# EAGLE design caliper (EAGLE 6.4)
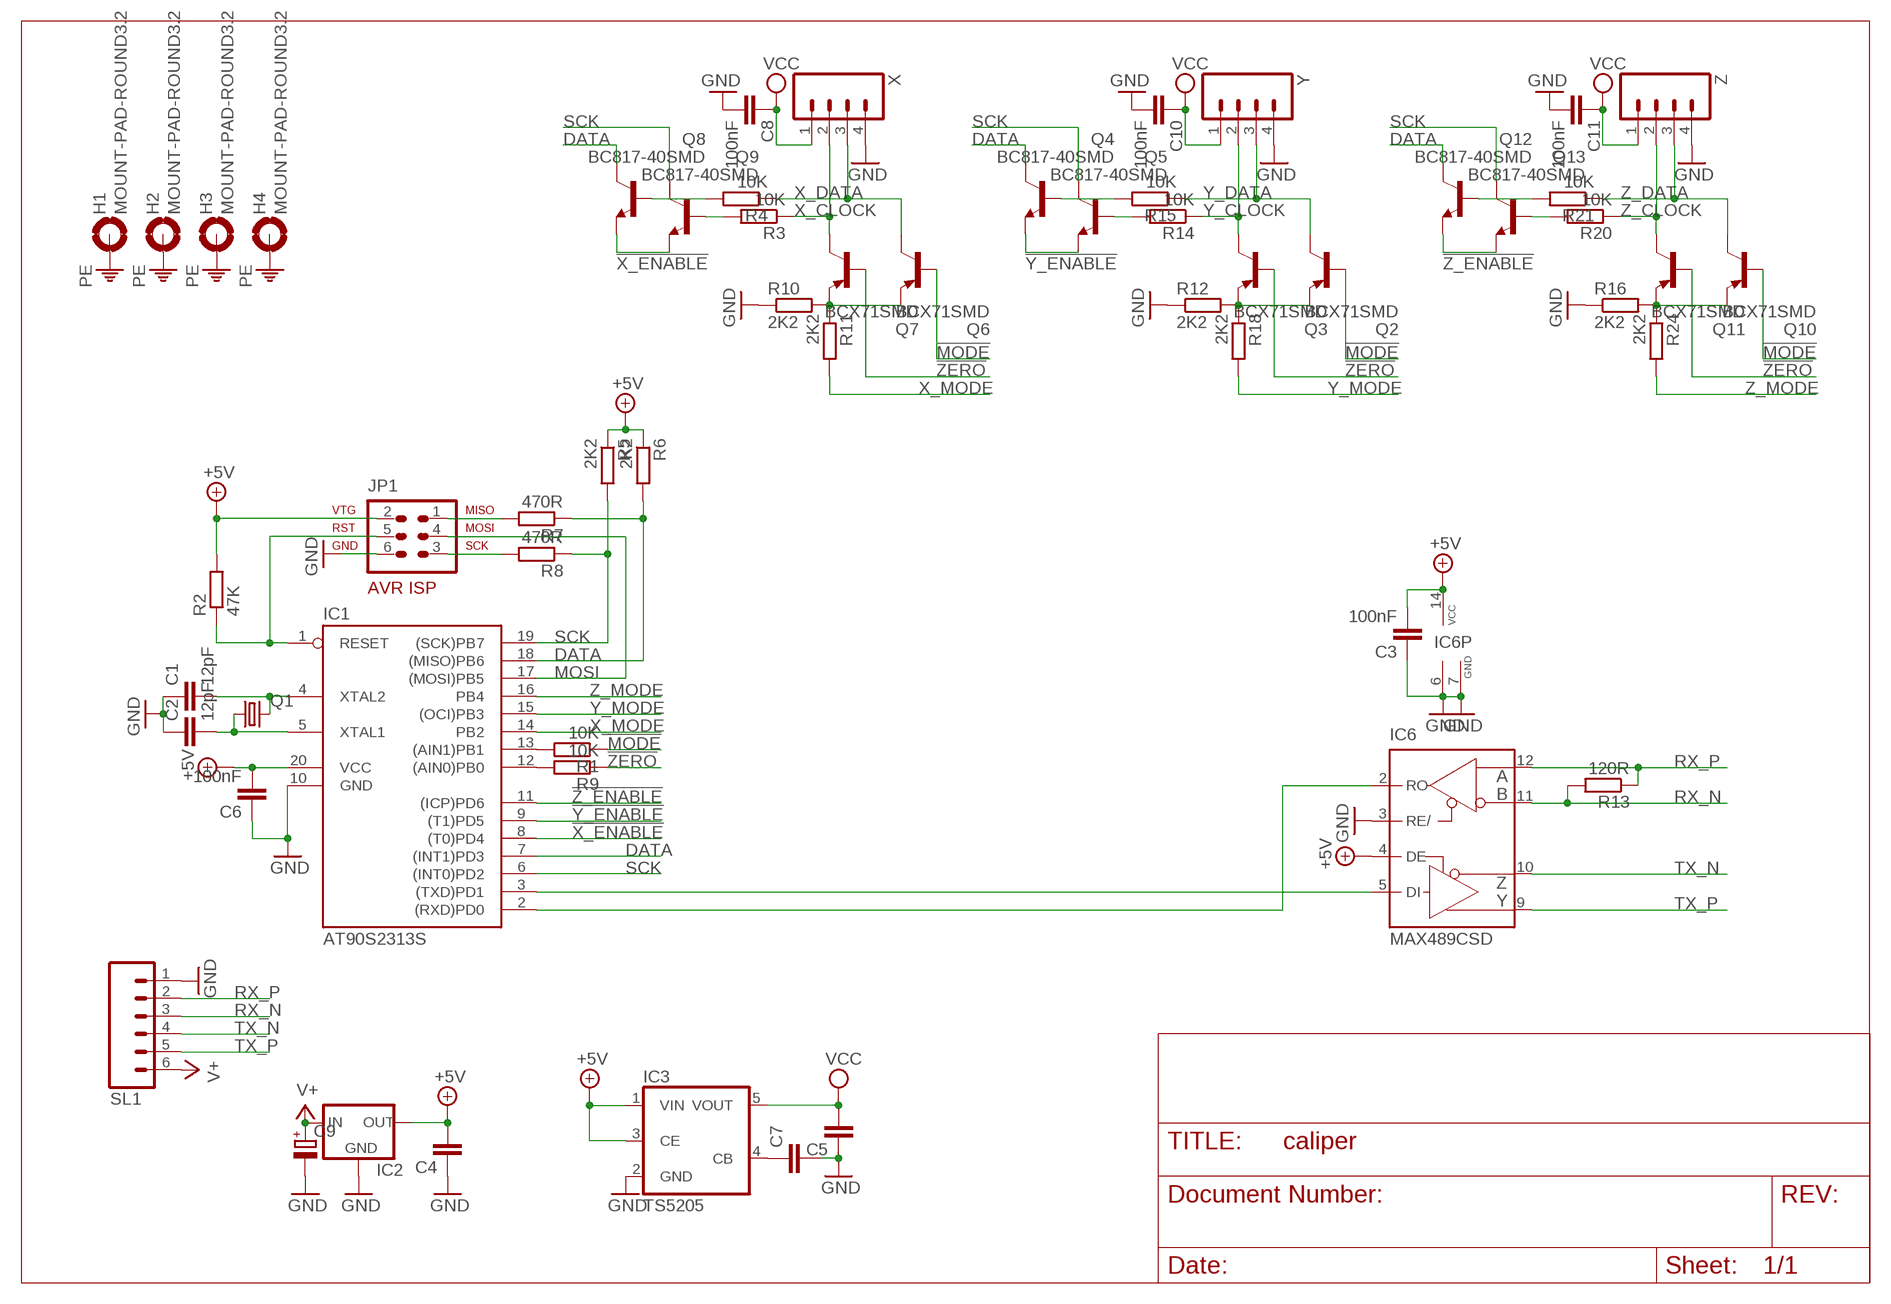
[diagram p0: schematic, sheet 1]

## Parts
C1  12pF  C-EUC0805  [C0805]
C2  12pF  C-EUC0805  [C0805]
C3  100nF  C-EUC0805  [C0805]
C4  C-EUC0805  [C0805]
C5  C-EUC0805  [C0805]
C6  100nF  C-EUC0805  [C0805]
C7  C-EUC0805  [C0805]
C8  100nF  C-EUC0805  [C0805]
C9  CPOL-EUE3.5-8  [E3,5-8]
C10  100nF  C-EUC0805  [C0805]
C11  100nF  C-EUC0805  [C0805]
H1  MOUNT-PAD-ROUND3.2  [3,2-PAD]
H2  MOUNT-PAD-ROUND3.2  [3,2-PAD]
H3  MOUNT-PAD-ROUND3.2  [3,2-PAD]
H4  MOUNT-PAD-ROUND3.2  [3,2-PAD]
IC1  AT90S2313S  [SO20L]
IC2  78XXS  [78XXS]
IC3  TS5205  [SOT25]
IC6  MAX489CSD  [SO14]
JP1  AVR-ISP-6  [AVR-ISP-6]
Q1  CRYTALHC49S  [HC49/S]
Q2  BCX71SMD  [SOT23]
Q3  BCX71SMD  [SOT23]
Q4  BC817-40SMD  [SOT23-BEC]
Q5  BC817-40SMD  [SOT23-BEC]
Q6  BCX71SMD  [SOT23]
Q7  BCX71SMD  [SOT23]
Q8  BC817-40SMD  [SOT23-BEC]
Q9  BC817-40SMD  [SOT23-BEC]
Q10  BCX71SMD  [SOT23]
Q11  BCX71SMD  [SOT23]
Q12  BC817-40SMD  [SOT23-BEC]
Q13  BC817-40SMD  [SOT23-BEC]
R1  10K  R-EU_R0805  [R0805]
R2  47K  R-EU_R0805  [R0805]
R3  10K  R-EU_R0805  [R0805]
R4  10K  R-EU_R0805  [R0805]
R5  2K2  R-EU_R0805  [R0805]
R6  2K2  R-EU_R0805  [R0805]
R7  470R  R-EU_R0805  [R0805]
R8  470R  R-EU_R0805  [R0805]
R9  10K  R-EU_R0805  [R0805]
R10  2K2  R-EU_R0805  [R0805]
R11  2K2  R-EU_R0805  [R0805]
R12  2K2  R-EU_R0805  [R0805]
R13  120R  R-EU_R0805  [R0805]
R14  10K  R-EU_R0805  [R0805]
R15  10K  R-EU_R0805  [R0805]
R16  2K2  R-EU_R0805  [R0805]
R18  2K2  R-EU_R0805  [R0805]
R20  10K  R-EU_R0805  [R0805]
R21  10K  R-EU_R0805  [R0805]
R24  2K2  R-EU_R0805  [R0805]
SL1  M06  [06P]
X  M04  [04P]
Y  M04  [04P]
Z  M04  [04P]

## Nets
!MODE: Q2.1(B) Q6.1(B) Q10.1(B) R1.1
!X_ENABLE: IC1.8((T0)PD4) Q8.E Q9.E
!Y_ENABLE: IC1.9((T1)PD5) Q4.E Q5.E
!Z_ENABLE: IC1.11((ICP)PD6) Q12.E Q13.E
!ZERO: Q3.1(B) Q7.1(B) Q11.1(B) R9.1
+5V: C3.2 C4.2 C6.2 IC1.20(VCC) IC2.OUT IC3.1(VIN) IC3.3(CE) IC6.4(DE) IC6.14(VCC) JP1.2 R2.2 R5.1 R6.1
DATA: IC1.7((INT1)PD3) IC1.18((MISO)PB6) Q4.C Q8.C Q12.C R6.2 R7.1
GND: C1.1 C2.1 C3.1 C4.1 C5.1 C6.1 C7.2 C8.2 C9.- C10.2 C11.2 IC1.10(GND) IC2.GND IC3.2(GND) IC6.3(RE/) IC6.6(GND) IC6.7(GND) JP1.6 R10.1 R12.1 R16.1 SL1.1 X.4 Y.4 Z.4
MOSI: IC1.17((MOSI)PB5) JP1.4
N$1: C1.2 IC1.4(XTAL2) Q1.2
N$2: C2.2 IC1.5(XTAL1) Q1.1
N$3: IC1.2((RXD)PD0) IC6.2(RO)
N$4: IC1.3((TXD)PD1) IC6.5(DI)
N$5: JP1.1 R7.2
N$6: IC1.12((AIN0)PB0) R9.2
N$7: IC1.1(RESET) JP1.5 R2.1
N$8: IC1.13((AIN1)PB1) R1.2
N$9: Q6.2(E) Q7.2(E) R10.2 R11.1
N$10: C7.1 IC3.4(CB)
N$11: JP1.3 R8.2
N$12: Q4.B R15.2
N$13: Q12.B R21.2
N$15: Q8.B R4.2
N$16: Q9.B R3.2
N$17: Q5.B R14.2
N$20: Q2.2(E) Q3.2(E) R12.2 R18.1
N$21: Q13.B R20.2
N$24: Q10.2(E) Q11.2(E) R16.2 R24.1
PE: H1.B3,2(MOUNT) H2.B3,2(MOUNT) H3.B3,2(MOUNT) H4.B3,2(MOUNT)
RX_N: IC6.11(B) R13.2 SL1.3
RX_P: IC6.12(A) R13.1 SL1.2
SCK: IC1.6((INT0)PD2) IC1.19((SCK)PB7) Q5.C Q9.C Q13.C R5.2 R8.1
TX_N: IC6.10(Z) SL1.4
TX_P: IC6.9(Y) SL1.5
V+: C9.+ IC2.IN SL1.6
VCC: C5.2 C8.1 C10.1 C11.1 IC3.5(VOUT) X.1 Y.1 Z.1
X_CLOCK: Q7.3(C) R3.1 X.2
X_DATA: Q6.3(C) R4.1 X.3
X_MODE: IC1.14(PB2) R11.2
Y_CLOCK: Q3.3(C) R14.1 Y.2
Y_DATA: Q2.3(C) R15.1 Y.3
Y_MODE: IC1.15((OCI)PB3) R18.2
Z_CLOCK: Q11.3(C) R20.1 Z.2
Z_DATA: Q10.3(C) R21.1 Z.3
Z_MODE: IC1.16(PB4) R24.2
Unconnected: IC6.1(NC) IC6.8(NC) IC6.13(NC)

## Library data of the parts
C1-C8 C10 C11 = rcl:C-EU: CAPACITOR, European symbol
C9 = rcl:CPOL-EU: POLARIZED CAPACITOR, European symbol
H1-H4 = holes:MOUNT-PAD-ROUND: MOUNTING PAD, round
IC1 = atmel:AT90S2313: MICROCONTROLLER 2 Kbytes FLASH 128 bytes SRAM 128 bytes EEPROM UART; OC_FARNELL: unknown; OC_NEWARK: unknown
IC2 = v-reg:78XXS: VOLTAGE REGULATOR
IC3 = v-reg:TS5205: 150mA Low Noise LDO Voltage Regulator with Enable TSC [Taiwan Semiconductor Company, Ltd] Source: http://www.taiwansemi.com .. 5205_0409c.pdf
IC6 = maxim-10:MAX489CSD: RS485 TRANSEIVER
JP1 = atmel:AVR-ISP-6: AVR ISP-6 Serial Programming Header
Q1 = crystal:CRYTAL: CRYSTAL
Q2 Q3 Q6 Q7 Q10 Q11 = transistor-pnp:BCX71SMD: PNP Transistor
Q4 Q5 Q8 Q9 Q12 Q13 = transistor-npn:BC817*: NPN Transistor
R1-R16 R18 R20 R21 R24 = rcl:R-EU_: RESISTOR, European symbol
SL1 = con-amp-quick:M06: AMP QUICK CONNECTOR; OC_FARNELL: unknown; OC_NEWARK: unknown
X Y Z = con-amp-quick:M04: AMP QUICK CONNECTOR; OC_FARNELL: unknown; OC_NEWARK: unknown

## Board
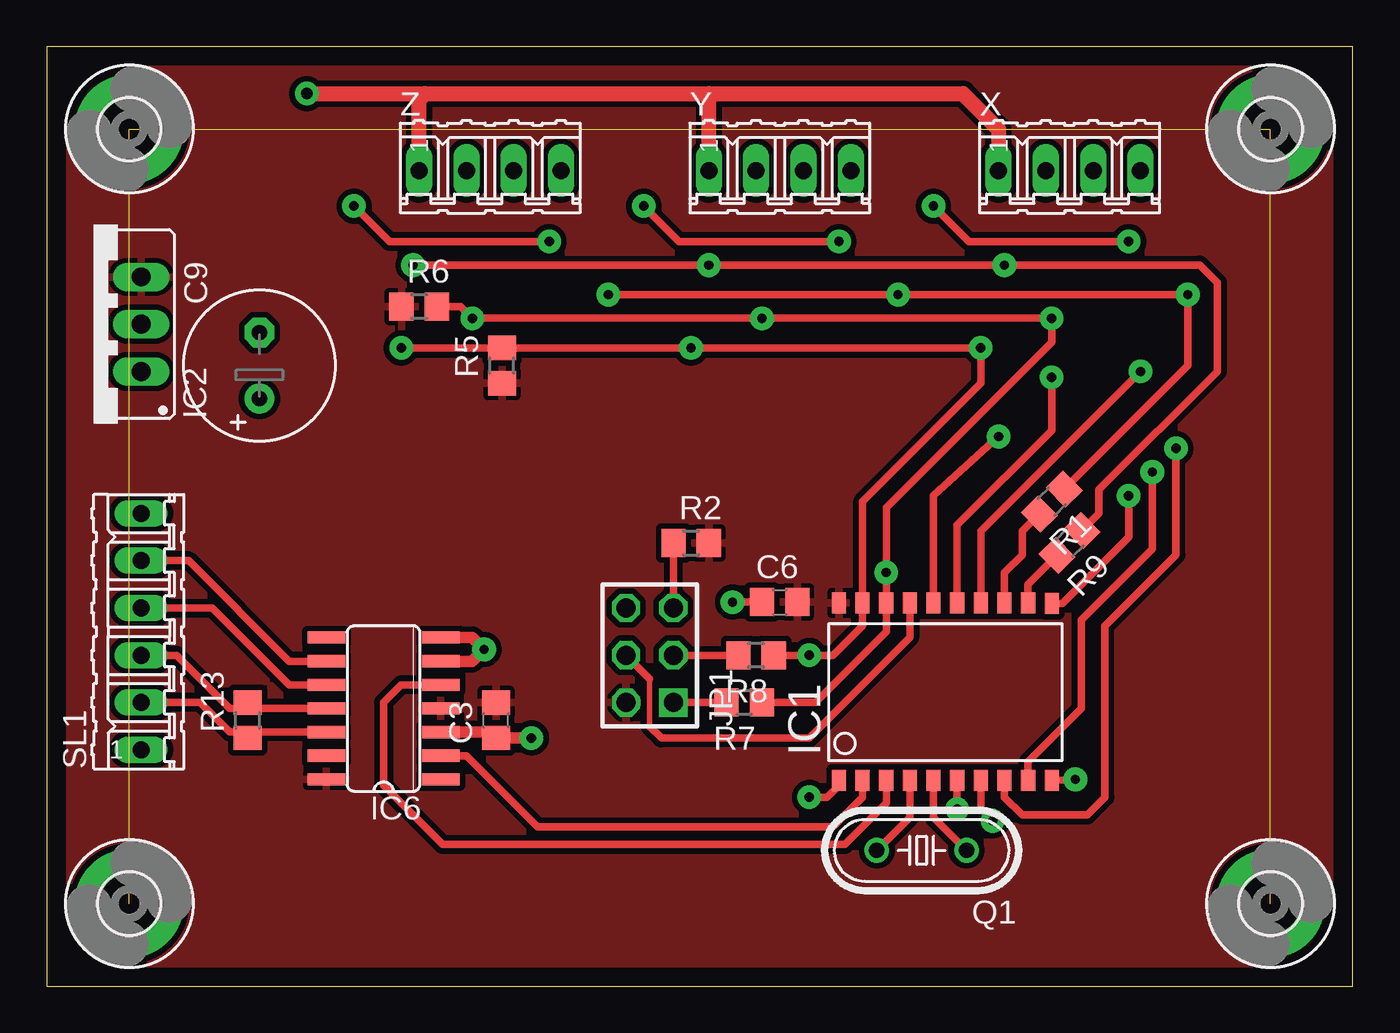
[diagram p1: board, top side]
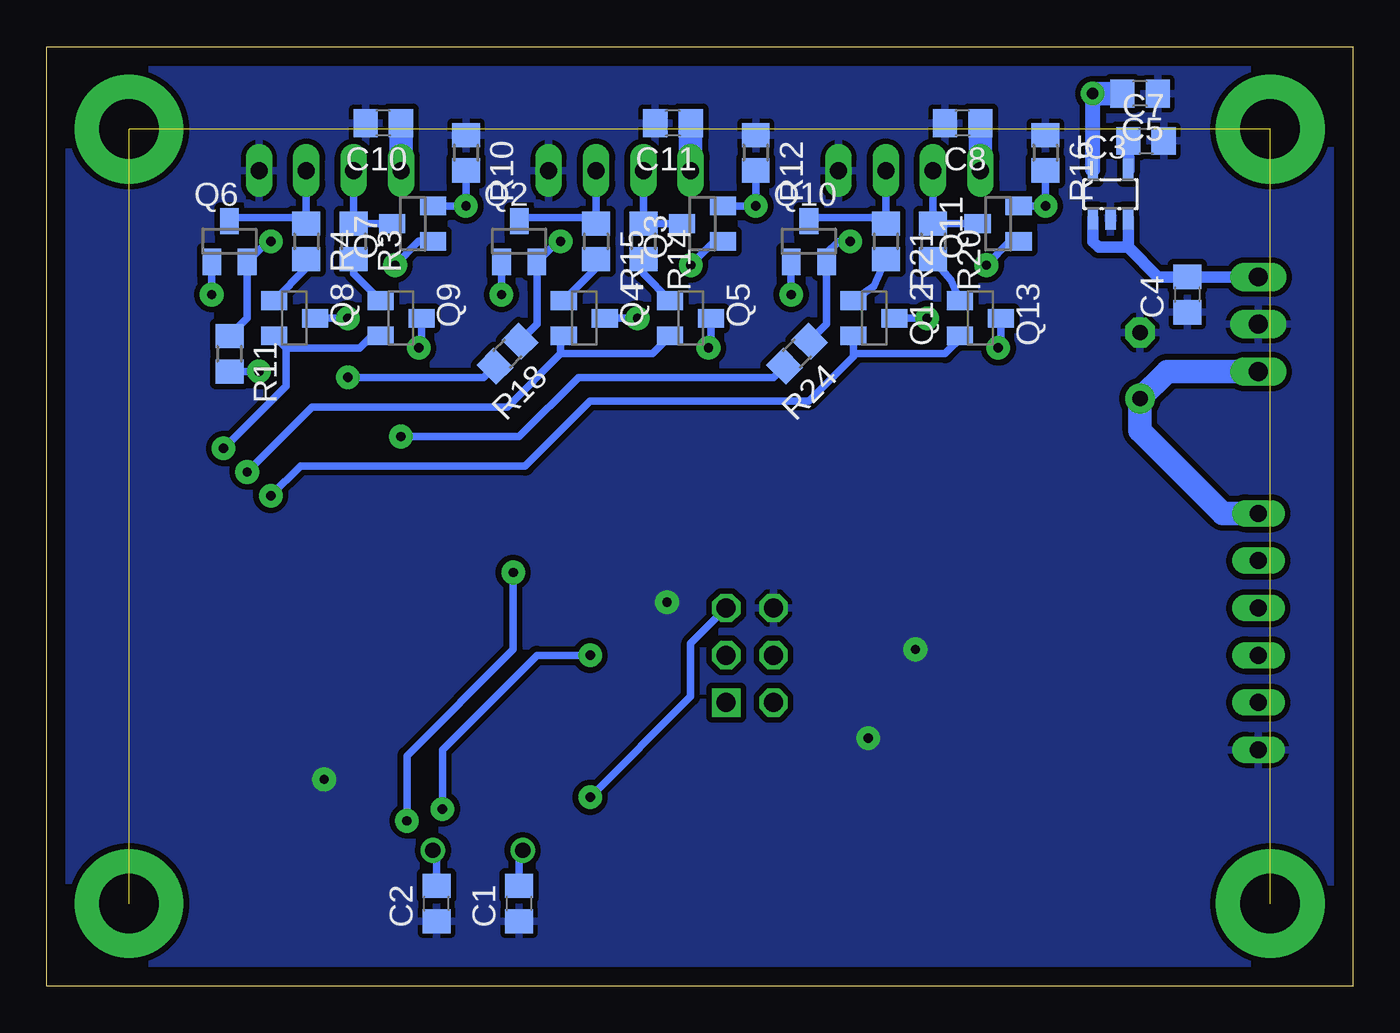
[diagram p2: board, bottom side, seen from below]

Size 70.15 x 50.47 mm. Coordinates in mm from the lower left corner, seen from the top.
Outline: 0,0 70.15,0 70.15,50.47 0,50.47 0,0
Copper layers (1*16): Top 0.035mm / dielectric 1.5mm / Bottom 0.035mm
Design rules "default": minimum track width 10mil, minimum drill 24mil, track to track 8mil, track to pad 8mil, pad to pad 8mil, via to via 8mil, smd to smd 8mil, copper to edge 40mil, drill to drill 8mil, minimum pad ring 10mil, minimum via ring 8mil, stop-mask expansion 4mil, vias tented up to drill 0mil, thermal gap 10mil

### Footprints (pad centres in the part's own frame; a part is rotated, then mirrored left to right if it is on the bottom)
C0805 = smd 1.3 x 1.5: 1 -0.95,0; 2 0.95,0
E3,5-8 = drill 0.813 pad 1.6: + -1.778,0 | drill 0.813 pad 1.6 octagon: - 1.778,0
3,2-PAD = drill 3.2 pad 5.842: B3,2 0,0
SO20L = smd 0.762 x 1.143: 1 -5.08,-5.131; 2 -3.81,-5.131; 3 -2.54,-5.131; 4 -1.27,-5.131; 5 0,-5.131; 6 1.27,-5.131; 7 2.54,-5.131; 8 3.81,-5.131; 9 5.08,-5.131; 10 6.35,-5.131; 11 6.35,4.369; 12 5.08,4.394; 13 3.81,4.394; 14 2.54,4.394; 15 1.27,4.394; 16 0,4.394; 17 -1.27,4.394; 18 -2.54,4.394; 19 -3.81,4.394; 20 -5.08,4.394
78XXS = drill 1.016 long: GND 0,-2.54; IN -2.54,-2.54; OUT 2.54,-2.54
SOT25 = smd 0.55 x 1.2: 1 -0.95,-1.3; 2 0,-1.3; 3 0.95,-1.3; 4 0.95,1.3; 5 -0.95,1.3
SO14 = smd 0.66 x 2.032: 1 -3.81,-3.073; 2 -2.54,-3.073; 3 -1.27,-3.073; 4 0,-3.073; 5 1.27,-3.073; 6 2.54,-3.073; 7 3.81,-3.073; 8 3.81,3.073; 9 2.54,3.073; 10 1.27,3.073; 11 0,3.073; 12 -1.27,3.073; 13 -2.54,3.073; 14 -3.81,3.073
AVR-ISP-6 = drill 1.016 square: 1 -2.54,-1.27 | drill 1.016 octagon: 2 -2.54,1.27; 3 0,-1.27; 4 0,1.27; 5 2.54,-1.27; 6 2.54,1.27
HC49/S = drill 0.813: 1 -2.413,0; 2 2.413,0
SOT23 = smd 1 x 1.4: 1 -0.95,-1.1; 2 0.95,-1.1; 3 0,1.1
SOT23-BEC = smd 1 x 1.4: B -0.95,-1.1; C 0,1.1; E 0.95,-1.1
R0805 = smd 1.3 x 1.5: 1 -0.95,0; 2 0.95,0
06P = drill 0.914 long: 1 -6.35,0; 2 -3.81,0; 3 -1.27,0; 4 1.27,0; 5 3.81,0; 6 6.35,0
04P = drill 0.914 long: 1 -3.81,0; 2 -1.27,0; 3 1.27,0; 4 3.81,0

### Placement (x,y rotation side)
C1  44.77,4.45 90 bottom
C2  49.21,4.45 90 bottom
C3  24.13,14.29 90 top
C4  8.89,37.15 90 bottom
C5  11.43,47.94 180 bottom
C6  39.37,20.64 0 top
C7  11.11,45.4 0 bottom
C8  20.95,46.35 180 bottom
C9  11.43,33.34 90 top
C10  52.07,46.35 180 bottom
C11  36.51,46.35 180 bottom
H1  65.72,4.45 0 top
H2  65.72,46.04 0 top
H3  4.45,46.04 0 top
H4  4.45,4.45 0 top
IC1  47.62,16.19 0 top
IC2  2.54,35.56 90 top
IC3  13.02,42.55 0 bottom
IC6  18.1,14.92 90 top
JP1  32.38,17.78 90 top
Q1  46.99,7.3 180 top
Q2  44.77,40.01 0 bottom
Q3  34.92,40.96 90 bottom
Q4  41.27,35.88 270 bottom
Q5  35.56,35.88 270 bottom
Q6  60.33,40.01 0 bottom
Q7  50.48,40.96 90 bottom
Q8  56.83,35.88 270 bottom
Q9  51.12,35.88 270 bottom
Q10  29.21,40.01 0 bottom
Q11  19.05,40.96 90 bottom
Q12  25.72,35.88 270 bottom
Q13  20,35.88 270 bottom
R1  53.98,26.04 225 top
R2  34.61,23.81 0 top
R3  53.66,40.01 270 bottom
R4  56.2,40.01 270 bottom
R5  24.45,33.34 90 top
R6  20,36.51 0 top
R7  37.47,15.24 180 top
R8  38.1,17.78 180 top
R9  54.93,23.81 225 top
R10  47.62,44.77 270 bottom
R11  60.33,33.97 270 bottom
R12  32.07,44.77 270 bottom
R13  10.79,14.29 90 top
R14  38.1,40.01 270 bottom
R15  40.64,40.01 270 bottom
R16  16.51,44.77 270 bottom
R18  45.4,33.97 225 bottom
R20  22.54,40.01 270 bottom
R21  25.08,40.01 270 bottom
R24  29.84,33.97 225 bottom
SL1  5.08,19.05 90 top
X  54.93,43.81 0 top
Y  39.37,43.81 0 top
Z  23.81,43.81 0 top

### Tracks (layer width: path | path; a pad name or v marks a point on that pad's centre or on a via)
!MODE  (via drill 0.5 pad 1.27)
  Top 0.406: v30.16,37.15 v45.72,37.15 v61.28,37.15 61.28,33.34 R1.1
  Bottom 0.406: v30.16,37.15 Q10.1 | v45.72,37.15 Q2.1 | v61.28,37.15 Q6.1
!X_ENABLE  (via drill 0.5 pad 1.27)
  Top 0.406: IC1.8 51.44,10.16 52.39,9.21 55.88,9.21 56.83,10.16 56.83,19.37 60.64,23.18 v60.64,28.89
  Bottom 0.406: Q9.E 52.7,34.93 53.34,34.29 57.3,34.29 | 57.3,34.29 Q8.E | 57.3,34.29 57.3,32.24 v60.64,28.89
!Y_ENABLE  (via drill 0.5 pad 1.27)
  Top 0.406: IC1.9 52.7,12.06 55.56,14.92 55.56,19.68 59.37,23.5 v59.37,27.62
  Bottom 0.406: Q4.E 42.55,34.61 42.55,33.97 | 42.55,33.97 37.62,33.97 Q5.E | 42.55,33.97 45.4,31.11 55.88,31.11 v59.37,27.62
!Z_ENABLE  (via drill 0.5 pad 1.27)
  Top 0.406: IC1.11 54.53,20.56 58.1,24.13 v58.1,26.35
  Bottom 0.406: Q13.E 20.95,34.93 21.91,33.97 26.82,33.97 | 26.82,33.97 Q12.E | 26.82,33.97 26.82,33.83 29.21,31.43 40.96,31.43 44.45,27.94 56.52,27.94 v58.1,26.35
!ZERO  (via drill 0.5 pad 1.27)
  Top 0.406: v19.68,38.73 v35.56,38.73 v51.44,38.73 61.91,38.73 62.87,37.78 62.87,33.02 56.52,26.67 56.52,25.4 R9.1
  Bottom 0.406: Q11.1 18.41,40.01 v19.68,38.73 | Q3.1 34.29,40.01 v35.56,38.73 | Q7.1 50.16,40.01 v51.44,38.73
+5V
  Bottom 0.61: IC3.3 12.07,39.69 | 12.07,39.69 10.48,38.1 C4.2 IC2.OUT | IC3.1 13.97,40 13.65,39.69 12.07,39.69
  pour Top (isolate 0.305, rank 3): 0.64,0.64 69.53,0.64 69.53,49.85 0.64,49.85
DATA  (via drill 0.5 pad 1.27)
  Top 0.406: R7.1 41.27,15.24 45.09,19.05 IC1.18 v45.09,22.23 45.09,25.72 53.98,34.61 v53.98,35.88 v38.42,35.88 v22.86,35.88 22.23,36.51 R6.2 | IC1.7 50.16,9.53 v50.8,8.89
  Bottom 0.406: Q4.C v38.42,35.88 | v22.86,35.88 Q12.C | Q8.C v53.98,35.88 | v50.8,8.89 50.8,12.38 45.09,18.1 v45.09,22.23
GND  (via drill 0.5 pad 1.27)
  Top 0.406: v55.24,11.11 IC1.10 | C6.1 v36.83,20.64
  Top 0.61: IC6.7 22.86,18.73 v23.5,18.1 22.86,17.46 IC6.6 | IC6.3 23.82,13.65 C3.1 v26.04,13.34
  pour Bottom (isolate 0.305, rank 3): 0.64,0.64 69.53,0.64 69.53,49.85 0.64,49.85
MOSI
  Top 0.305: 32.38,13.97 32.38,16.51
  Top 0.406: IC1.17 46.35,18.73 40.96,13.34 33.02,13.34 32.38,13.97 | 32.38,16.51 JP1.4
N$1
  Top 0.406: IC1.4 46.35,9.08 Q1.2
  Bottom 0.406: C1.2 44.77,7.11 Q1.2
N$2
  Top 0.406: IC1.5 47.62,9.08 Q1.1
  Bottom 0.406: C2.2 49.21,7.11 Q1.1
N$3
  Top 0.406: IC6.2 22.54,12.38 26.35,8.57 42.23,8.57 43.81,10.16 IC1.2
N$4
  Top 0.406: IC6.5 19.05,16.19 18.1,15.24 18.1,10.79 21.27,7.62 42.86,7.62 45.09,9.84 IC1.3
N$5
  Top 0.406: JP1.1 R7.2
N$6
  Top 0.406: IC1.12 52.7,21.59 R9.2
N$7  (via drill 0.5 pad 1.27)
  Top 0.406: JP1.5 R2.1 | IC1.1 42.55,10.79 41.91,10.16 v40.96,10.16
  Bottom 0.406: v40.96,10.16 35.56,15.56 35.56,18.41 JP1.5
N$8
  Top 0.406: IC1.13 51.44,22.23 52.39,23.18 52.39,24.45 R1.2
N$9  (via drill 0.5 pad 1.27)
  Top 0.406: v58.1,40.01 49.53,40.01 v47.62,41.91
  Bottom 0.406: R11.1 59.37,35.88 59.37,37.78 59.38,38.1 Q6.2 58.27,40.01 v58.1,40.01 | Q7.2 v47.62,41.91 R10.2
N$10
  Bottom 0.61: C7.1 12.04,43.82 IC3.4
N$11
  Top 0.406: JP1.3 R8.2
N$12
  Bottom 0.406: R15.2 40.64,38.56 Q4.B
N$13
  Bottom 0.406: R21.2 25.71,37.61 Q12.B
N$15
  Bottom 0.406: R4.2 56.2,38.56 Q8.B
N$16
  Bottom 0.406: R3.2 53.66,38.27 Q9.B
N$17
  Bottom 0.406: R14.2 38.1,38.27 Q5.B
N$20  (via drill 0.5 pad 1.27)
  Top 0.406: v42.55,40.01 33.97,40.01 v32.07,41.91
  Bottom 0.406: R18.1 43.81,35.56 43.81,37.47 43.82,38.1 Q2.2 42.72,40.01 v42.55,40.01 | Q3.2 v32.07,41.91 R12.2
N$21
  Bottom 0.406: R20.2 21.59,37.92 Q13.B
N$24  (via drill 0.5 pad 1.27)
  Top 0.406: v26.99,40.01 18.41,40.01 v16.51,41.91
  Bottom 0.406: R24.1 28.26,35.56 28.26,37.78 28.26,38.41 Q10.2 28.26,39.37 27.62,40.01 v26.99,40.01 | Q11.2 v16.51,41.91 R16.2
PE  (3 unrouted)
RX_N
  Top 0.406: IC6.11 11.11,14.92 R13.2 10.48,14.92 9.84,14.92 6.99,17.78 SL1.3
RX_P
  Top 0.406: IC6.12 11.11,13.65 R13.1 10.48,13.65 9.84,13.65 8.26,15.24 SL1.2
SCK  (via drill 0.5 pad 1.27)
  Top 0.406: R8.1 v40.96,17.78 42.23,17.78 43.81,19.37 IC1.19 43.81,26.04 50.16,32.38 v50.16,34.29 v34.61,34.29 v19.05,34.29 R5.2 | IC1.6 v48.9,9.53
  Bottom 0.406: Q13.C 18.9,34.44 v19.05,34.29 | Q5.C 34.46,34.44 v34.61,34.29 | Q9.C 50.02,34.44 v50.16,34.29 | v48.9,9.53 48.9,12.7 43.81,17.78 v40.96,17.78
TX_N
  Top 0.406: IC6.10 13.02,16.19 9.05,20.16 8.89,20.32 SL1.4
TX_P
  Top 0.406: IC6.9 13.02,17.46 7.62,22.86 SL1.5
V+
  Bottom 1.27: IC2.IN 9.97,33.02 C9.+ 11.43,29.84 6.99,25.4 SL1.6
VCC  (via drill 0.61 pad 1.27)
  Top 0.813: v13.97,47.94 20.32,47.94 | 20.32,47.94 35.56,47.94 | 35.56,47.94 49.21,47.94 51.12,46.04 X.1 | Y.1 35.56,47.94 | Z.1 20,47.62 20.32,47.94
  Bottom 0.813: IC3.5 13.97,45.72 v13.97,47.94
  Bottom 1.27: C8.1 Z.1 | C11.1 Y.1 | C10.1 X.1 | C5.2 v13.97,47.94
X_CLOCK
  Bottom 0.406: X.2 R3.1 Q7.3
X_DATA
  Bottom 0.406: X.3 R4.1 56.52,41.27 60.17,41.27 Q6.3
X_MODE  (via drill 0.5 pad 1.27)
  Top 0.406: IC1.14 50.16,24.45 v58.74,33.02
  Bottom 0.406: R11.2 v58.74,33.02
Y_CLOCK
  Bottom 0.406: Y.2 R14.1 Q3.3
Y_DATA
  Bottom 0.406: Y.3 R15.1 41.27,41.27 41.28,41.27 44.62,41.27 Q2.3
Y_MODE  (via drill 0.5 pad 1.27)
  Top 0.406: IC1.15 48.9,24.77 53.98,29.84 v53.98,32.7
  Bottom 0.406: R18.2 46.67,32.7 v53.98,32.7
Z_CLOCK
  Bottom 0.406: Z.2 R20.1 Q11.3
Z_DATA
  Bottom 0.406: Z.3 R21.1 25.4,40.96 25.72,41.27 27.62,41.27 28.89,41.27 29.06,41.27 Q10.3
Z_MODE  (via drill 0.5 pad 1.27)
  Top 0.406: IC1.16 47.62,26.35 v51.12,29.53
  Bottom 0.406: v51.12,29.53 44.77,29.53 41.59,32.7 31.11,32.7 R24.2